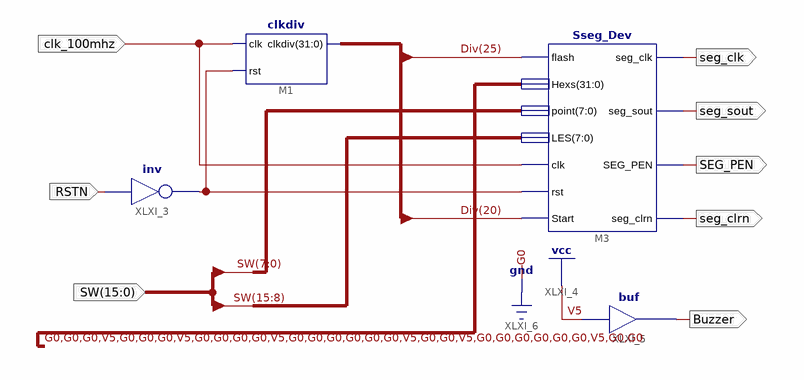
[diagram p0: schematic sheet 1]
// Xilinx ISE schematic Hex827Seg.sch (kintex7) as structural Verilog: 4 symbols, 8 ports
module Hex827Seg (
  input  clk_100mhz,
  input  [15:0] SW,
  input  RSTN,
  output seg_clk,
  output seg_sout,
  output SEG_PEN,
  output seg_clrn,
  output Buzzer
);

  wire XLXN_17;
  wire [31:0] Div;

  Sseg_Dev M3 (
    .flash(Div[25]), .Hexs(32'b00010001000010000001001000000100), .point(SW[7:0]), .LES(SW[15:8]),
    .clk(clk_100mhz), .rst(XLXN_17), .Start(Div[20]), .seg_clk(seg_clk), .seg_sout(seg_sout),
    .SEG_PEN(SEG_PEN), .seg_clrn(seg_clrn));
  clkdiv M1 (.clkdiv(Div), .clk(clk_100mhz), .rst(XLXN_17));
  buf XLXI_5 (Buzzer, 1'b1);
  not XLXI_3 (XLXN_17, RSTN);
endmodule
